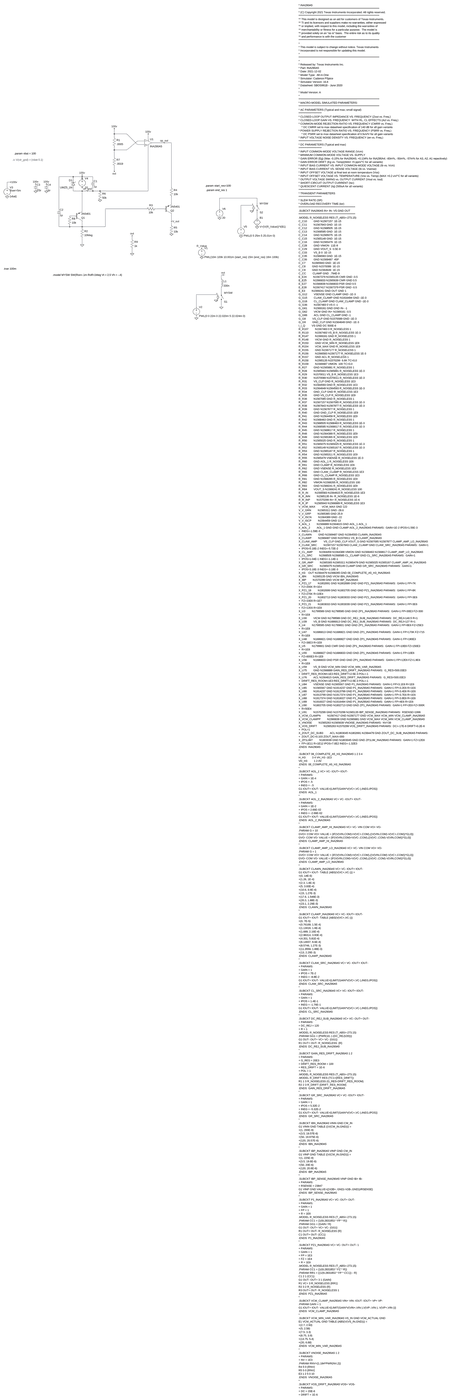
[diagram p0: schematic high_common_mode_shunt.asc, whole sheet]
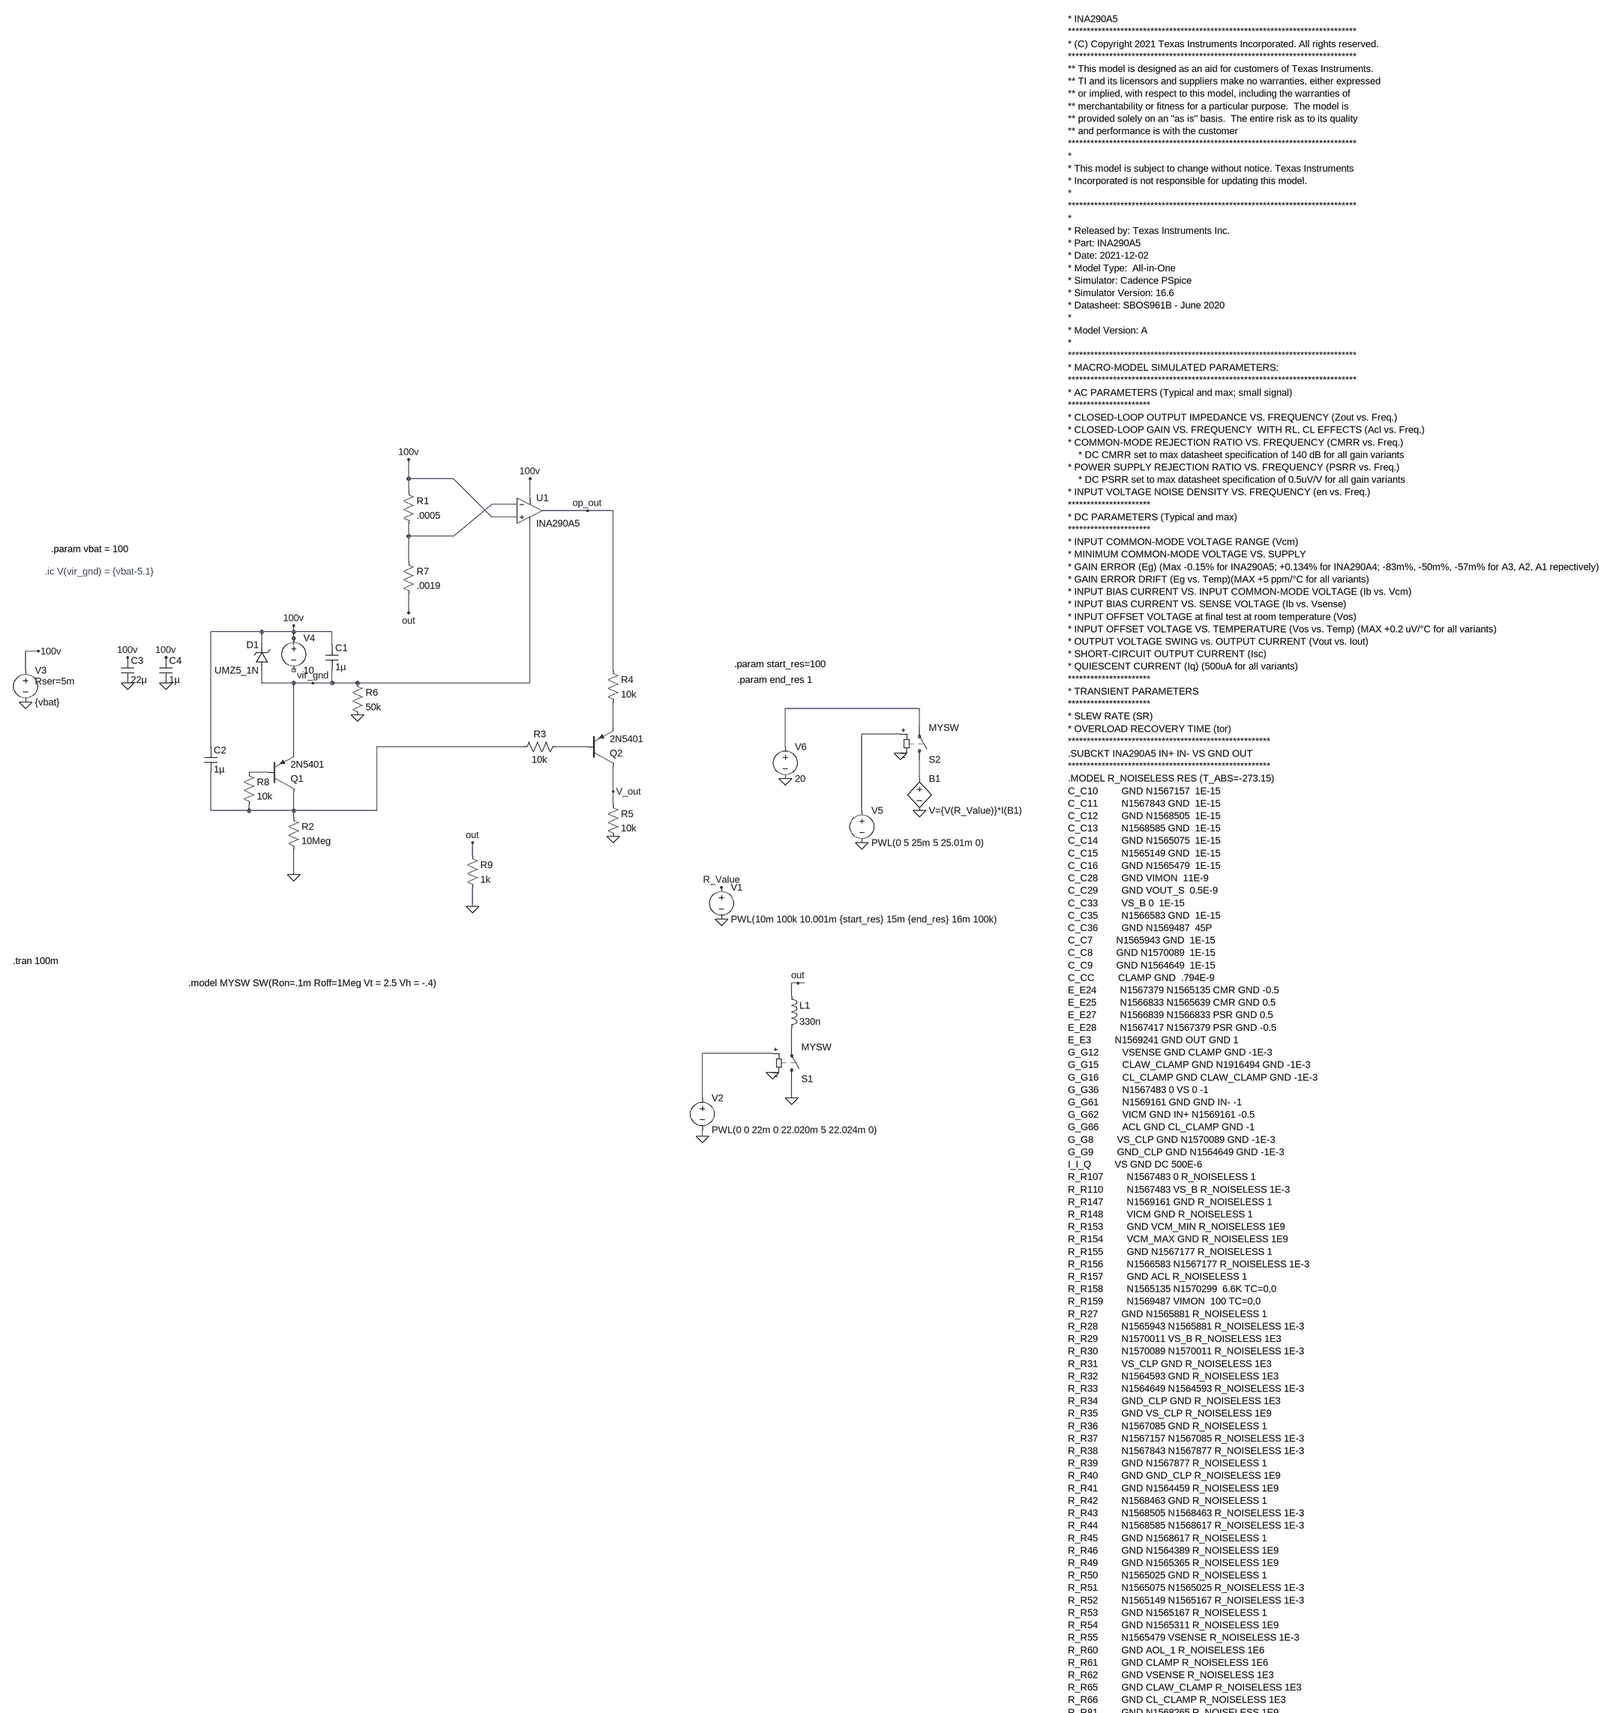
[diagram p1: schematic high_common_mode_shunt.asc, part, row 1 of 3, column 1 of 1]
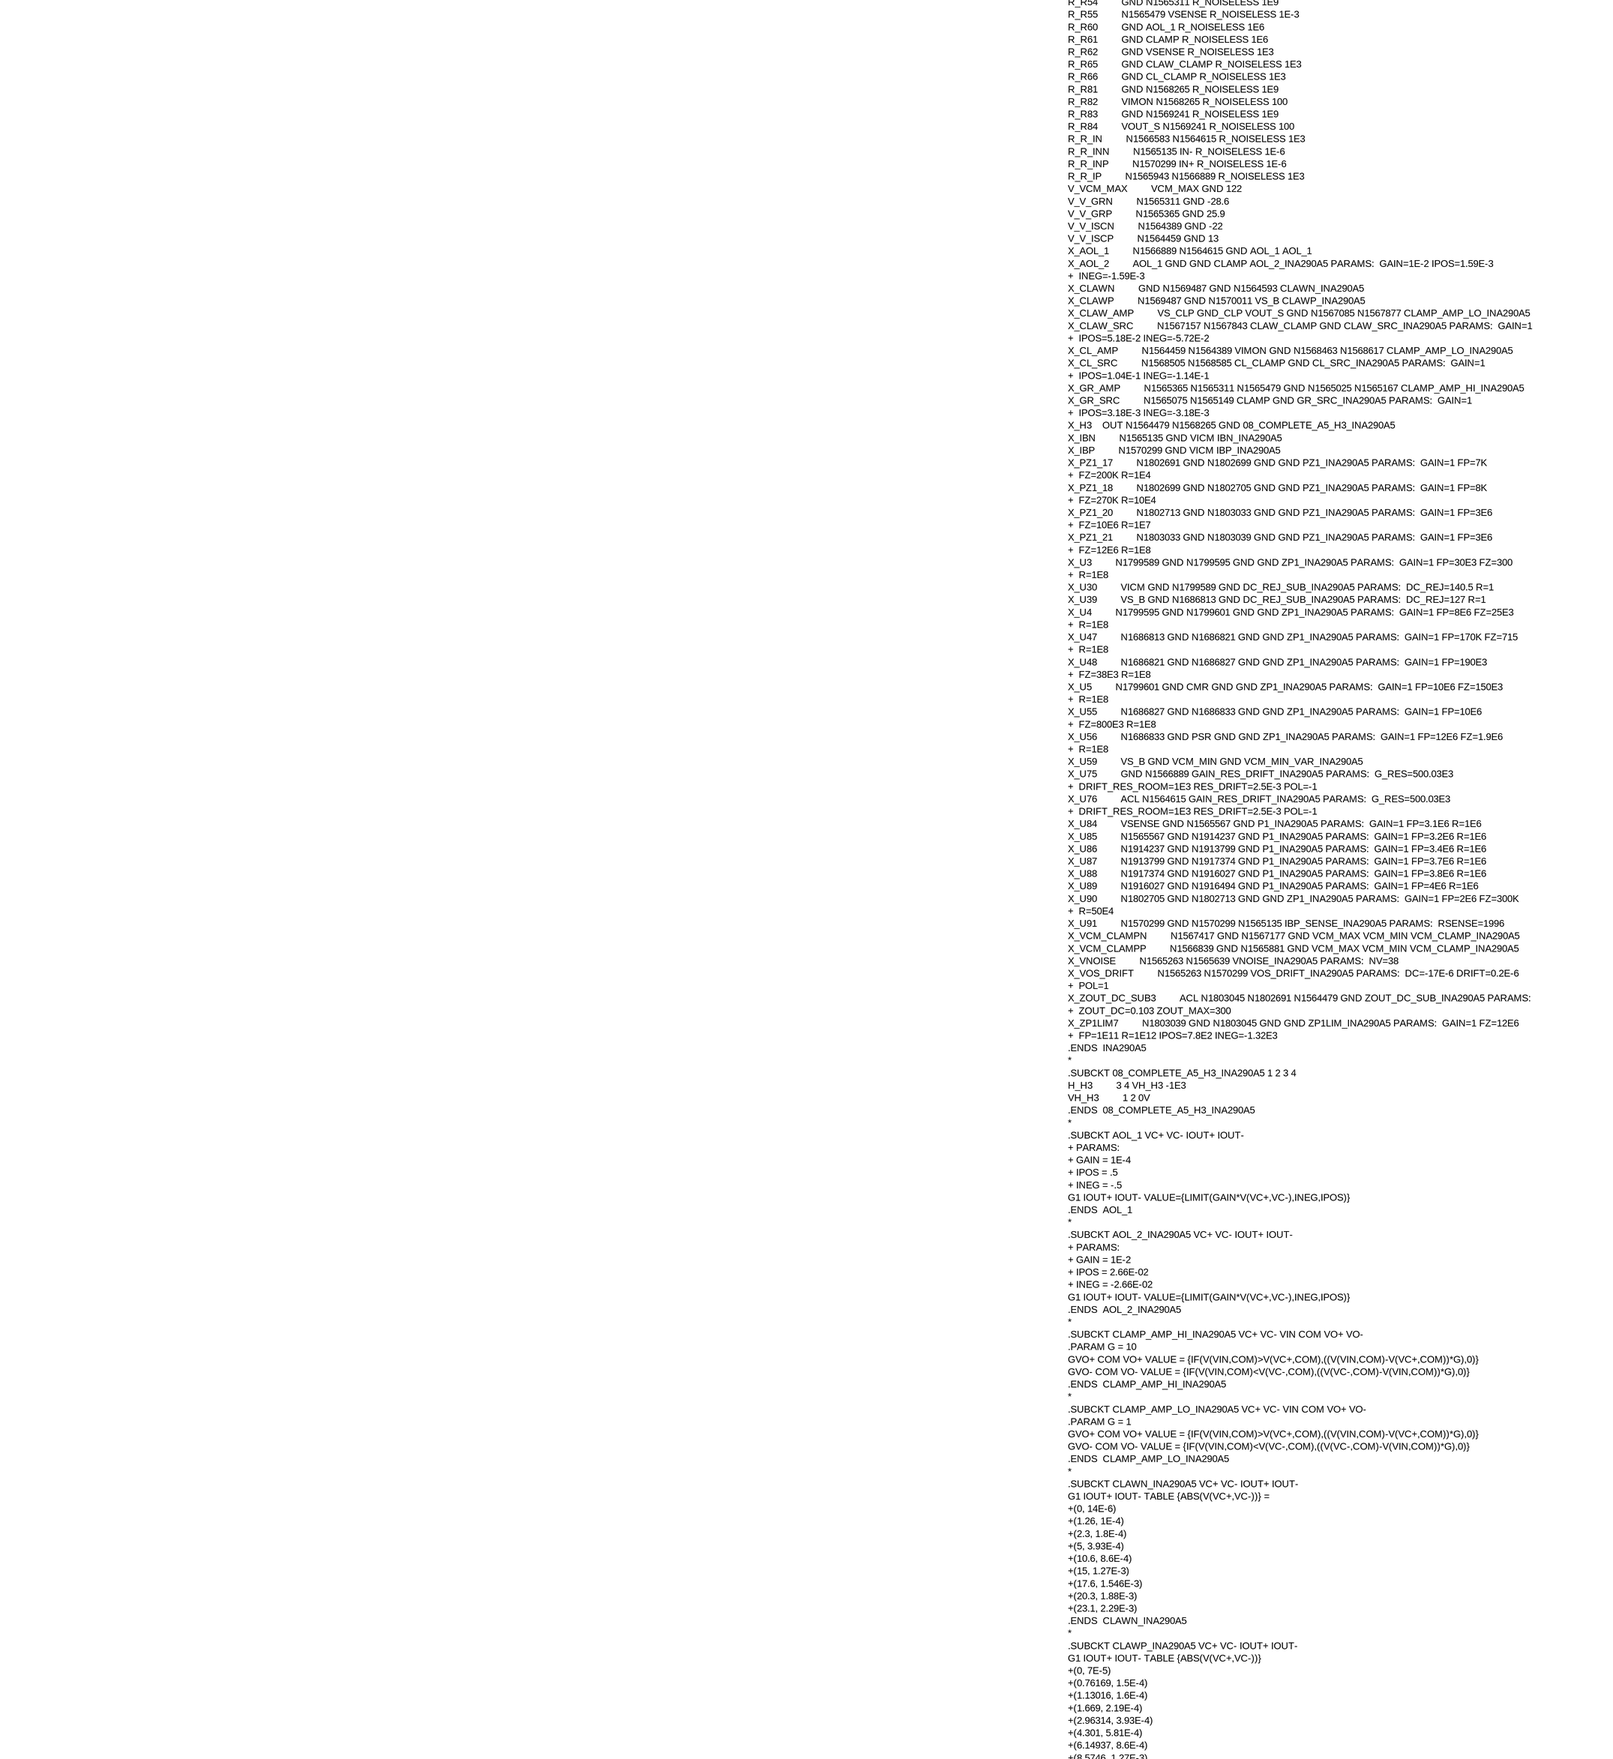
[diagram p2: schematic high_common_mode_shunt.asc, part, row 2 of 3, column 1 of 1]
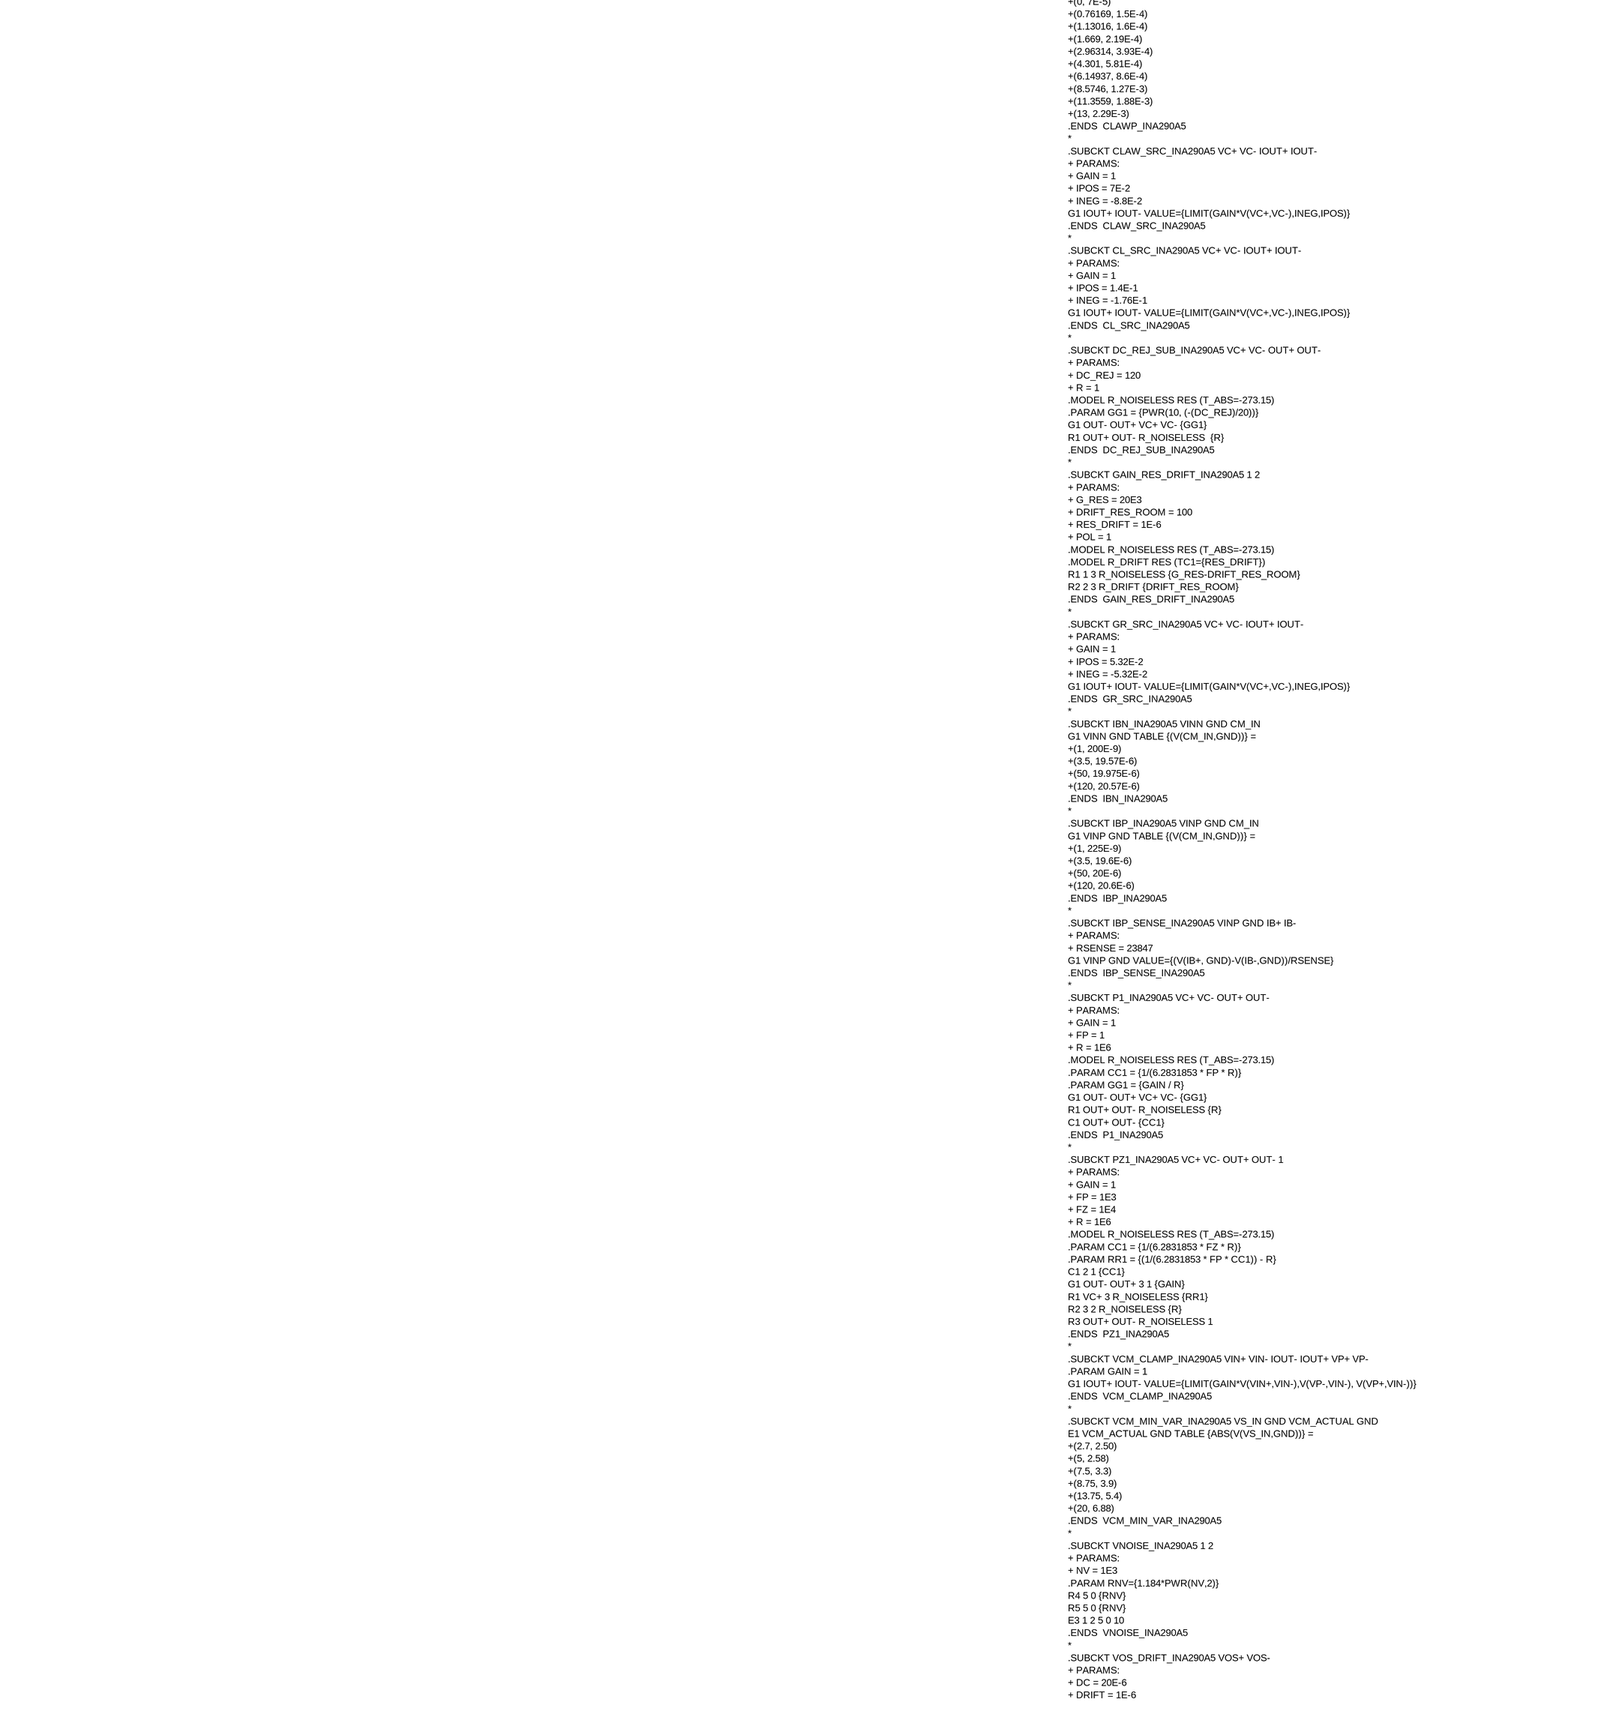
[diagram p3: schematic high_common_mode_shunt.asc, part, row 3 of 3, column 1 of 1]
high_common_mode_shunt.asc, the LTspice schematic file:
Version 4
SHEET 1 2880 10728
WIRE -704 -848 -704 -896
WIRE -592 -848 -704 -848
WIRE -704 -816 -704 -848
WIRE -400 -800 -400 -848
WIRE -432 -784 -496 -784
WIRE -256 -768 -368 -768
WIRE -192 -768 -256 -768
WIRE -496 -752 -592 -848
WIRE -432 -752 -496 -752
WIRE -704 -704 -704 -736
WIRE -592 -704 -496 -784
WIRE -592 -704 -704 -704
WIRE -704 -640 -704 -704
WIRE -704 -512 -704 -560
WIRE -1072 -464 -1200 -464
WIRE -992 -464 -992 -480
WIRE -992 -464 -1072 -464
WIRE -896 -464 -992 -464
WIRE -992 -448 -992 -464
WIRE -1072 -432 -1072 -464
WIRE -992 -432 -992 -448
WIRE -896 -432 -896 -464
WIRE -1632 -416 -1664 -416
WIRE -1664 -368 -1664 -416
WIRE -192 -368 -192 -768
WIRE -1072 -336 -1072 -368
WIRE -992 -336 -1072 -336
WIRE -944 -336 -992 -336
WIRE -896 -336 -896 -368
WIRE -896 -336 -944 -336
WIRE -832 -336 -896 -336
WIRE -400 -336 -400 -736
WIRE -400 -336 -832 -336
WIRE 720 -272 384 -272
WIRE -192 -224 -192 -288
WIRE 720 -224 720 -272
WIRE 672 -208 576 -208
WIRE -1200 -176 -1200 -464
WIRE -416 -176 -784 -176
WIRE -256 -176 -336 -176
WIRE 384 -176 384 -272
WIRE -992 -160 -992 -336
WIRE -1056 -112 -1104 -112
WIRE 720 -96 720 -144
WIRE -192 -64 -192 -128
WIRE -192 -32 -192 -64
WIRE -1200 -16 -1200 -112
WIRE -1104 -16 -1104 -32
WIRE -1104 -16 -1200 -16
WIRE -992 -16 -992 -64
WIRE -992 -16 -1104 -16
WIRE -784 -16 -784 -176
WIRE -784 -16 -992 -16
WIRE 576 -16 576 -208
WIRE -992 0 -992 -16
WIRE -544 96 -544 64
WIRE -992 144 -992 80
WIRE -544 224 -544 176
WIRE 416 416 400 416
WIRE 432 416 416 416
WIRE 400 448 400 416
WIRE 400 576 400 528
WIRE 352 592 176 592
WIRE 176 704 176 592
WIRE 400 704 400 656
WIRE 176 800 176 784
FLAG 720 -16 0
FLAG 224 256 0
FLAG 224 176 R_Value
FLAG 400 704 0
FLAG 416 416 out
FLAG -704 -896 100v
FLAG -1664 -288 0
FLAG -1632 -416 100v
FLAG -400 -848 100v
FLAG -992 -480 100v
FLAG -192 48 0
FLAG -192 -64 V_out
FLAG -256 -768 op_out
FLAG -704 -512 out
FLAG -832 -256 0
FLAG -944 -336 vir_gnd
FLAG -992 144 0
FLAG -1408 -336 0
FLAG -1408 -400 100v
FLAG -1312 -336 0
FLAG -1312 -400 100v
FLAG -544 64 out
FLAG -544 224 0
FLAG 672 -160 0
FLAG 352 640 0
FLAG 176 800 0
FLAG 576 64 0
FLAG 384 -96 0
SYMBOL bv 720 -112 R0
SYMATTR InstName B1
SYMATTR Value V={V(R_Value)}*I(B1)
SYMBOL voltage 224 160 R0
WINDOW 123 0 0 Left 0
WINDOW 39 0 0 Left 0
SYMATTR InstName V1
SYMATTR Value PWL(10m 100k 10.001m {start_res} 15m {end_res} 16m 100k)
SYMBOL sw 400 672 M180
SYMATTR InstName S1
SYMATTR Value MYSW
SYMBOL voltage 176 688 R0
WINDOW 123 0 0 Left 0
WINDOW 39 0 0 Left 0
SYMATTR InstName V2
SYMATTR Value PWL(0 0 22m 0 22.020m 5 22.024m 0)
SYMBOL ind 384 432 R0
SYMATTR InstName L1
SYMATTR Value 330n
SYMATTR SpiceLine Rser=1m
SYMBOL res -720 -832 R0
SYMATTR InstName R1
SYMATTR Value .0005
SYMBOL voltage -1664 -384 R0
WINDOW 123 0 0 Left 0
WINDOW 39 24 44 Left 2
SYMATTR SpiceLine Rser=5m
SYMATTR InstName V3
SYMATTR Value {vbat}
SYMBOL OpAmps\\opamp2 -400 -832 R0
SYMATTR InstName U1
SYMATTR Value INA290A5
SYMBOL pnp -1056 -64 M180
SYMATTR InstName Q1
SYMATTR Value 2N5401
SYMBOL res -1008 -16 R0
SYMATTR InstName R2
SYMATTR Value 10Meg
SYMBOL res -208 -384 R0
SYMATTR InstName R4
SYMATTR Value 10k
SYMBOL res -208 -48 R0
SYMATTR InstName R5
SYMATTR Value 10k
SYMBOL pnp -256 -128 M180
SYMATTR InstName Q2
SYMATTR Value 2N5401
SYMBOL res -848 -352 R0
SYMATTR InstName R6
SYMATTR Value 50k
SYMBOL cap -912 -432 R0
SYMATTR InstName C1
SYMATTR Value 1µ
SYMBOL cap -1216 -176 R0
SYMATTR InstName C2
SYMATTR Value 1µ
SYMBOL cap -1424 -400 R0
SYMATTR InstName C3
SYMATTR Value 22µ
SYMATTR SpiceLine Irms=.5 Rser=.080
SYMBOL cap -1328 -400 R0
SYMATTR InstName C4
SYMATTR Value 1µ
SYMATTR SpiceLine Rser=.005
SYMBOL res -720 -656 R0
SYMATTR InstName R7
SYMATTR Value .0019
SYMBOL res -560 80 R0
SYMATTR InstName R9
SYMATTR Value 1k
SYMBOL voltage -992 -464 R0
WINDOW 123 0 0 Left 0
WINDOW 39 0 0 Left 0
SYMATTR InstName V4
SYMATTR Value 10
SYMBOL sw 720 -128 M180
SYMATTR InstName S2
SYMATTR Value MYSW
SYMBOL voltage 576 -32 R0
WINDOW 123 0 0 Left 0
WINDOW 39 0 0 Left 0
SYMATTR InstName V5
SYMATTR Value PWL(0 5 25m 5 25.01m 0)
SYMBOL voltage 384 -192 R0
WINDOW 123 0 0 Left 0
WINDOW 39 0 0 Left 0
SYMATTR InstName V6
SYMATTR Value 20
SYMBOL res -320 -192 R90
WINDOW 0 0 56 VBottom 2
WINDOW 3 32 56 VTop 2
SYMATTR InstName R3
SYMATTR Value 10k
SYMBOL zener -1056 -368 R180
WINDOW 0 24 64 Left 2
WINDOW 3 24 0 Left 2
SYMATTR InstName D1
SYMATTR Value UMZ5_1N
SYMATTR Description Diode
SYMATTR Type diode
SYMBOL res -1120 -128 R0
SYMATTR InstName R8
SYMATTR Value 10k
TEXT -1696 360 Left 2 !.tran 100m
TEXT 1408 -2000 Left 2 !* INA290A5\n*****************************************************************************\n* (C) Copyright 2021 Texas Instruments Incorporated. All rights reserved.   \n*****************************************************************************\n** This model is designed as an aid for customers of Texas Instruments.\n** TI and its licensors and suppliers make no warranties, either expressed\n** or implied, with respect to this model, including the warranties of\n** merchantability or fitness for a particular purpose.  The model is\n** provided solely on an "as is" basis.  The entire risk as to its quality\n** and performance is with the customer\n*****************************************************************************\n*\n* This model is subject to change without notice. Texas Instruments\n* Incorporated is not responsible for updating this model.\n*\n*****************************************************************************\n*\n* Released by: Texas Instruments Inc.\n* Part: INA290A5\n* Date: 2021-12-02\n* Model Type:  All-in-One\n* Simulator: Cadence PSpice\n* Simulator Version: 16.6\n* Datasheet: SBOS961B - June 2020\n*\n* Model Version: A\n*\n*****************************************************************************   \n* MACRO-MODEL SIMULATED PARAMETERS:\n*****************************************************************************\n* AC PARAMETERS (Typical and max; small signal)\n**********************\n* CLOSED-LOOP OUTPUT IMPEDANCE VS. FREQUENCY (Zout vs. Freq.)\n* CLOSED-LOOP GAIN VS. FREQUENCY  WITH RL, CL EFFECTS (Acl vs. Freq.)\n* COMMON-MODE REJECTION RATIO VS. FREQUENCY (CMRR vs. Freq.)\n    * DC CMRR set to max datasheet specification of 140 dB for all gain variants\n* POWER SUPPLY REJECTION RATIO VS. FREQUENCY (PSRR vs. Freq.)\n    * DC PSRR set to max datasheet specification of 0.5uV/V for all gain variants\n* INPUT VOLTAGE NOISE DENSITY VS. FREQUENCY (en vs. Freq.)\n**********************\n* DC PARAMETERS (Typical and max)\n**********************\n* INPUT COMMON-MODE VOLTAGE RANGE (Vcm)\n* MINIMUM COMMON-MODE VOLTAGE VS. SUPPLY\n* GAIN ERROR (Eg) (Max -0.15% for INA290A5; +0.134% for INA290A4; -83m%, -50m%, -57m% for A3, A2, A1 repectively)\n* GAIN ERROR DRIFT (Eg vs. Temp)(MAX +5 ppm/°C for all variants)\n* INPUT BIAS CURRENT VS. INPUT COMMON-MODE VOLTAGE (Ib vs. Vcm)\n* INPUT BIAS CURRENT VS. SENSE VOLTAGE (Ib vs. Vsense)\n* INPUT OFFSET VOLTAGE at final test at room temperature (Vos)\n* INPUT OFFSET VOLTAGE VS. TEMPERATURE (Vos vs. Temp) (MAX +0.2 uV/°C for all variants)\n* OUTPUT VOLTAGE SWING vs. OUTPUT CURRENT (Vout vs. Iout)\n* SHORT-CIRCUIT OUTPUT CURRENT (Isc)\n* QUIESCENT CURRENT (Iq) (500uA for all variants)\n**********************\n* TRANSIENT PARAMETERS\n**********************\n* SLEW RATE (SR)\n* OVERLOAD RECOVERY TIME (tor)\n******************************************************\n.SUBCKT INA290A5 IN+ IN- VS GND OUT\n******************************************************\n.MODEL R_NOISELESS RES (T_ABS=-273.15)\nC_C10         GND N1567157  1E-15   \nC_C11         N1567843 GND  1E-15   \nC_C12         GND N1568505  1E-15   \nC_C13         N1568585 GND  1E-15   \nC_C14         GND N1565075  1E-15   \nC_C15         N1565149 GND  1E-15   \nC_C16         GND N1565479  1E-15   \nC_C28         GND VIMON  11E-9   \nC_C29         GND VOUT_S  0.5E-9   \nC_C33         VS_B 0  1E-15   \nC_C35         N1566583 GND  1E-15   \nC_C36         GND N1569487  45P   \nC_C7         N1565943 GND  1E-15   \nC_C8         GND N1570089  1E-15   \nC_C9         GND N1564649  1E-15   \nC_CC         CLAMP GND  .794E-9   \nE_E24         N1567379 N1565135 CMR GND -0.5\nE_E25         N1566833 N1565639 CMR GND 0.5\nE_E27         N1566839 N1566833 PSR GND 0.5\nE_E28         N1567417 N1567379 PSR GND -0.5\nE_E3         N1569241 GND OUT GND 1\nG_G12         VSENSE GND CLAMP GND -1E-3\nG_G15         CLAW_CLAMP GND N1916494 GND -1E-3\nG_G16         CL_CLAMP GND CLAW_CLAMP GND -1E-3\nG_G36         N1567483 0 VS 0 -1\nG_G61         N1569161 GND GND IN- -1\nG_G62         VICM GND IN+ N1569161 -0.5\nG_G66         ACL GND CL_CLAMP GND -1\nG_G8         VS_CLP GND N1570089 GND -1E-3\nG_G9         GND_CLP GND N1564649 GND -1E-3\nI_I_Q         VS GND DC 500E-6  \nR_R107         N1567483 0 R_NOISELESS 1\nR_R110         N1567483 VS_B R_NOISELESS 1E-3\nR_R147         N1569161 GND R_NOISELESS 1\nR_R148         VICM GND R_NOISELESS 1\nR_R153         GND VCM_MIN R_NOISELESS 1E9\nR_R154         VCM_MAX GND R_NOISELESS 1E9\nR_R155         GND N1567177 R_NOISELESS 1\nR_R156         N1566583 N1567177 R_NOISELESS 1E-3\nR_R157         GND ACL R_NOISELESS 1\nR_R158         N1565135 N1570299  6.6K TC=0,0 \nR_R159         N1569487 VIMON  100 TC=0,0 \nR_R27         GND N1565881 R_NOISELESS 1\nR_R28         N1565943 N1565881 R_NOISELESS 1E-3\nR_R29         N1570011 VS_B R_NOISELESS 1E3\nR_R30         N1570089 N1570011 R_NOISELESS 1E-3\nR_R31         VS_CLP GND R_NOISELESS 1E3\nR_R32         N1564593 GND R_NOISELESS 1E3\nR_R33         N1564649 N1564593 R_NOISELESS 1E-3\nR_R34         GND_CLP GND R_NOISELESS 1E3\nR_R35         GND VS_CLP R_NOISELESS 1E9\nR_R36         N1567085 GND R_NOISELESS 1\nR_R37         N1567157 N1567085 R_NOISELESS 1E-3\nR_R38         N1567843 N1567877 R_NOISELESS 1E-3\nR_R39         GND N1567877 R_NOISELESS 1\nR_R40         GND GND_CLP R_NOISELESS 1E9\nR_R41         GND N1564459 R_NOISELESS 1E9\nR_R42         N1568463 GND R_NOISELESS 1\nR_R43         N1568505 N1568463 R_NOISELESS 1E-3\nR_R44         N1568585 N1568617 R_NOISELESS 1E-3\nR_R45         GND N1568617 R_NOISELESS 1\nR_R46         GND N1564389 R_NOISELESS 1E9\nR_R49         GND N1565365 R_NOISELESS 1E9\nR_R50         N1565025 GND R_NOISELESS 1\nR_R51         N1565075 N1565025 R_NOISELESS 1E-3\nR_R52         N1565149 N1565167 R_NOISELESS 1E-3\nR_R53         GND N1565167 R_NOISELESS 1\nR_R54         GND N1565311 R_NOISELESS 1E9\nR_R55         N1565479 VSENSE R_NOISELESS 1E-3\nR_R60         GND AOL_1 R_NOISELESS 1E6\nR_R61         GND CLAMP R_NOISELESS 1E6\nR_R62         GND VSENSE R_NOISELESS 1E3\nR_R65         GND CLAW_CLAMP R_NOISELESS 1E3\nR_R66         GND CL_CLAMP R_NOISELESS 1E3\nR_R81         GND N1568265 R_NOISELESS 1E9\nR_R82         VIMON N1568265 R_NOISELESS 100\nR_R83         GND N1569241 R_NOISELESS 1E9\nR_R84         VOUT_S N1569241 R_NOISELESS 100\nR_R_IN         N1566583 N1564615 R_NOISELESS 1E3\nR_R_INN         N1565135 IN- R_NOISELESS 1E-6\nR_R_INP         N1570299 IN+ R_NOISELESS 1E-6\nR_R_IP         N1565943 N1566889 R_NOISELESS 1E3\nV_VCM_MAX         VCM_MAX GND 122\nV_V_GRN         N1565311 GND -28.6\nV_V_GRP         N1565365 GND 25.9\nV_V_ISCN         N1564389 GND -22\nV_V_ISCP         N1564459 GND 13\nX_AOL_1         N1566889 N1564615 GND AOL_1 AOL_1 \nX_AOL_2         AOL_1 GND GND CLAMP AOL_2_INA290A5 PARAMS:  GAIN=1E-2 IPOS=1.59E-3\n+  INEG=-1.59E-3\nX_CLAWN         GND N1569487 GND N1564593 CLAWN_INA290A5 \nX_CLAWP         N1569487 GND N1570011 VS_B CLAWP_INA290A5 \nX_CLAW_AMP         VS_CLP GND_CLP VOUT_S GND N1567085 N1567877 CLAMP_AMP_LO_INA290A5 \nX_CLAW_SRC         N1567157 N1567843 CLAW_CLAMP GND CLAW_SRC_INA290A5 PARAMS:  GAIN=1\n+  IPOS=5.18E-2 INEG=-5.72E-2\nX_CL_AMP         N1564459 N1564389 VIMON GND N1568463 N1568617 CLAMP_AMP_LO_INA290A5 \nX_CL_SRC         N1568505 N1568585 CL_CLAMP GND CL_SRC_INA290A5 PARAMS:  GAIN=1\n+  IPOS=1.04E-1 INEG=-1.14E-1\nX_GR_AMP         N1565365 N1565311 N1565479 GND N1565025 N1565167 CLAMP_AMP_HI_INA290A5 \nX_GR_SRC         N1565075 N1565149 CLAMP GND GR_SRC_INA290A5 PARAMS:  GAIN=1\n+  IPOS=3.18E-3 INEG=-3.18E-3\nX_H3    OUT N1564479 N1568265 GND 08_COMPLETE_A5_H3_INA290A5 \nX_IBN         N1565135 GND VICM IBN_INA290A5 \nX_IBP         N1570299 GND VICM IBP_INA290A5 \nX_PZ1_17         N1802691 GND N1802699 GND GND PZ1_INA290A5 PARAMS:  GAIN=1 FP=7K\n+  FZ=200K R=1E4\nX_PZ1_18         N1802699 GND N1802705 GND GND PZ1_INA290A5 PARAMS:  GAIN=1 FP=8K\n+  FZ=270K R=10E4\nX_PZ1_20         N1802713 GND N1803033 GND GND PZ1_INA290A5 PARAMS:  GAIN=1 FP=3E6\n+  FZ=10E6 R=1E7\nX_PZ1_21         N1803033 GND N1803039 GND GND PZ1_INA290A5 PARAMS:  GAIN=1 FP=3E6\n+  FZ=12E6 R=1E8\nX_U3         N1799589 GND N1799595 GND GND ZP1_INA290A5 PARAMS:  GAIN=1 FP=30E3 FZ=300\n+  R=1E8\nX_U30         VICM GND N1799589 GND DC_REJ_SUB_INA290A5 PARAMS:  DC_REJ=140.5 R=1\nX_U39         VS_B GND N1686813 GND DC_REJ_SUB_INA290A5 PARAMS:  DC_REJ=127 R=1\nX_U4         N1799595 GND N1799601 GND GND ZP1_INA290A5 PARAMS:  GAIN=1 FP=8E6 FZ=25E3\n+  R=1E8\nX_U47         N1686813 GND N1686821 GND GND ZP1_INA290A5 PARAMS:  GAIN=1 FP=170K FZ=715\n+  R=1E8\nX_U48         N1686821 GND N1686827 GND GND ZP1_INA290A5 PARAMS:  GAIN=1 FP=190E3\n+  FZ=38E3 R=1E8\nX_U5         N1799601 GND CMR GND GND ZP1_INA290A5 PARAMS:  GAIN=1 FP=10E6 FZ=150E3\n+  R=1E8\nX_U55         N1686827 GND N1686833 GND GND ZP1_INA290A5 PARAMS:  GAIN=1 FP=10E6\n+  FZ=800E3 R=1E8\nX_U56         N1686833 GND PSR GND GND ZP1_INA290A5 PARAMS:  GAIN=1 FP=12E6 FZ=1.9E6\n+  R=1E8\nX_U59         VS_B GND VCM_MIN GND VCM_MIN_VAR_INA290A5 \nX_U75         GND N1566889 GAIN_RES_DRIFT_INA290A5 PARAMS:  G_RES=500.03E3\n+  DRIFT_RES_ROOM=1E3 RES_DRIFT=2.5E-3 POL=-1\nX_U76         ACL N1564615 GAIN_RES_DRIFT_INA290A5 PARAMS:  G_RES=500.03E3\n+  DRIFT_RES_ROOM=1E3 RES_DRIFT=2.5E-3 POL=-1\nX_U84         VSENSE GND N1565567 GND P1_INA290A5 PARAMS:  GAIN=1 FP=3.1E6 R=1E6\nX_U85         N1565567 GND N1914237 GND P1_INA290A5 PARAMS:  GAIN=1 FP=3.2E6 R=1E6\nX_U86         N1914237 GND N1913799 GND P1_INA290A5 PARAMS:  GAIN=1 FP=3.4E6 R=1E6\nX_U87         N1913799 GND N1917374 GND P1_INA290A5 PARAMS:  GAIN=1 FP=3.7E6 R=1E6\nX_U88         N1917374 GND N1916027 GND P1_INA290A5 PARAMS:  GAIN=1 FP=3.8E6 R=1E6\nX_U89         N1916027 GND N1916494 GND P1_INA290A5 PARAMS:  GAIN=1 FP=4E6 R=1E6\nX_U90         N1802705 GND N1802713 GND GND ZP1_INA290A5 PARAMS:  GAIN=1 FP=2E6 FZ=300K\n+  R=50E4\nX_U91         N1570299 GND N1570299 N1565135 IBP_SENSE_INA290A5 PARAMS:  RSENSE=1996\nX_VCM_CLAMPN         N1567417 GND N1567177 GND VCM_MAX VCM_MIN VCM_CLAMP_INA290A5 \nX_VCM_CLAMPP         N1566839 GND N1565881 GND VCM_MAX VCM_MIN VCM_CLAMP_INA290A5 \nX_VNOISE         N1565263 N1565639 VNOISE_INA290A5 PARAMS:  NV=38\nX_VOS_DRIFT         N1565263 N1570299 VOS_DRIFT_INA290A5 PARAMS:  DC=-17E-6 DRIFT=0.2E-6\n+  POL=1\nX_ZOUT_DC_SUB3         ACL N1803045 N1802691 N1564479 GND ZOUT_DC_SUB_INA290A5 PARAMS: \n+  ZOUT_DC=0.103 ZOUT_MAX=300\nX_ZP1LIM7         N1803039 GND N1803045 GND GND ZP1LIM_INA290A5 PARAMS:  GAIN=1 FZ=12E6\n+  FP=1E11 R=1E12 IPOS=7.8E2 INEG=-1.32E3\n.ENDS  INA290A5\n*\n.SUBCKT 08_COMPLETE_A5_H3_INA290A5 1 2 3 4  \nH_H3         3 4 VH_H3 -1E3\nVH_H3         1 2 0V\n.ENDS  08_COMPLETE_A5_H3_INA290A5\n*\n.SUBCKT AOL_1 VC+ VC- IOUT+ IOUT-\n+ PARAMS:\n+ GAIN = 1E-4\n+ IPOS = .5\n+ INEG = -.5\nG1 IOUT+ IOUT- VALUE={LIMIT(GAIN*V(VC+,VC-),INEG,IPOS)}\n.ENDS  AOL_1\n*\n.SUBCKT AOL_2_INA290A5 VC+ VC- IOUT+ IOUT-\n+ PARAMS:\n+ GAIN = 1E-2\n+ IPOS = 2.66E-02\n+ INEG = -2.66E-02\nG1 IOUT+ IOUT- VALUE={LIMIT(GAIN*V(VC+,VC-),INEG,IPOS)}\n.ENDS  AOL_2_INA290A5\n*\n.SUBCKT CLAMP_AMP_HI_INA290A5 VC+ VC- VIN COM VO+ VO-\n.PARAM G = 10\nGVO+ COM VO+ VALUE = {IF(V(VIN,COM)>V(VC+,COM),((V(VIN,COM)-V(VC+,COM))*G),0)}\nGVO- COM VO- VALUE = {IF(V(VIN,COM)<V(VC-,COM),((V(VC-,COM)-V(VIN,COM))*G),0)}\n.ENDS  CLAMP_AMP_HI_INA290A5\n*\n.SUBCKT CLAMP_AMP_LO_INA290A5 VC+ VC- VIN COM VO+ VO-\n.PARAM G = 1\nGVO+ COM VO+ VALUE = {IF(V(VIN,COM)>V(VC+,COM),((V(VIN,COM)-V(VC+,COM))*G),0)}\nGVO- COM VO- VALUE = {IF(V(VIN,COM)<V(VC-,COM),((V(VC-,COM)-V(VIN,COM))*G),0)}\n.ENDS  CLAMP_AMP_LO_INA290A5\n*\n.SUBCKT CLAWN_INA290A5 VC+ VC- IOUT+ IOUT-\nG1 IOUT+ IOUT- TABLE {ABS(V(VC+,VC-))} =\n+(0, 14E-6)\n+(1.26, 1E-4)\n+(2.3, 1.8E-4)\n+(5, 3.93E-4)\n+(10.6, 8.6E-4)\n+(15, 1.27E-3)\n+(17.6, 1.546E-3)\n+(20.3, 1.88E-3)\n+(23.1, 2.29E-3)\n.ENDS  CLAWN_INA290A5\n*\n.SUBCKT CLAWP_INA290A5 VC+ VC- IOUT+ IOUT-\nG1 IOUT+ IOUT- TABLE {ABS(V(VC+,VC-))}\n+(0, 7E-5)\n+(0.76169, 1.5E-4)\n+(1.13016, 1.6E-4)\n+(1.669, 2.19E-4)\n+(2.96314, 3.93E-4)\n+(4.301, 5.81E-4)\n+(6.14937, 8.6E-4)\n+(8.5746, 1.27E-3)\n+(11.3559, 1.88E-3)\n+(13, 2.29E-3)\n.ENDS  CLAWP_INA290A5\n*\n.SUBCKT CLAW_SRC_INA290A5 VC+ VC- IOUT+ IOUT-\n+ PARAMS:\n+ GAIN = 1\n+ IPOS = 7E-2\n+ INEG = -8.8E-2\nG1 IOUT+ IOUT- VALUE={LIMIT(GAIN*V(VC+,VC-),INEG,IPOS)}\n.ENDS  CLAW_SRC_INA290A5\n*\n.SUBCKT CL_SRC_INA290A5 VC+ VC- IOUT+ IOUT-\n+ PARAMS:\n+ GAIN = 1\n+ IPOS = 1.4E-1\n+ INEG = -1.76E-1\nG1 IOUT+ IOUT- VALUE={LIMIT(GAIN*V(VC+,VC-),INEG,IPOS)}\n.ENDS  CL_SRC_INA290A5\n*\n.SUBCKT DC_REJ_SUB_INA290A5 VC+ VC- OUT+ OUT-\n+ PARAMS:\n+ DC_REJ = 120\n+ R = 1\n.MODEL R_NOISELESS RES (T_ABS=-273.15)\n.PARAM GG1 = {PWR(10, (-(DC_REJ)/20))}\nG1 OUT- OUT+ VC+ VC- {GG1}\nR1 OUT+ OUT- R_NOISELESS  {R}\n.ENDS  DC_REJ_SUB_INA290A5\n*\n.SUBCKT GAIN_RES_DRIFT_INA290A5 1 2\n+ PARAMS:\n+ G_RES = 20E3\n+ DRIFT_RES_ROOM = 100\n+ RES_DRIFT = 1E-6\n+ POL = 1\n.MODEL R_NOISELESS RES (T_ABS=-273.15)\n.MODEL R_DRIFT RES (TC1={RES_DRIFT})\nR1 1 3 R_NOISELESS {G_RES-DRIFT_RES_ROOM}\nR2 2 3 R_DRIFT {DRIFT_RES_ROOM}\n.ENDS  GAIN_RES_DRIFT_INA290A5\n*\n.SUBCKT GR_SRC_INA290A5 VC+ VC- IOUT+ IOUT-\n+ PARAMS:\n+ GAIN = 1\n+ IPOS = 5.32E-2\n+ INEG = -5.32E-2\nG1 IOUT+ IOUT- VALUE={LIMIT(GAIN*V(VC+,VC-),INEG,IPOS)}\n.ENDS  GR_SRC_INA290A5\n*\n.SUBCKT IBN_INA290A5 VINN GND CM_IN\nG1 VINN GND TABLE {(V(CM_IN,GND))} =\n+(1, 200E-9)\n+(3.5, 19.57E-6)\n+(50, 19.975E-6)\n+(120, 20.57E-6)\n.ENDS  IBN_INA290A5\n*\n.SUBCKT IBP_INA290A5 VINP GND CM_IN\nG1 VINP GND TABLE {(V(CM_IN,GND))} =\n+(1, 225E-9)\n+(3.5, 19.6E-6)\n+(50, 20E-6)\n+(120, 20.6E-6)\n.ENDS  IBP_INA290A5\n*\n.SUBCKT IBP_SENSE_INA290A5 VINP GND IB+ IB-\n+ PARAMS:\n+ RSENSE = 23847\nG1 VINP GND VALUE={(V(IB+, GND)-V(IB-,GND))/RSENSE}\n.ENDS  IBP_SENSE_INA290A5\n*\n.SUBCKT P1_INA290A5 VC+ VC- OUT+ OUT-\n+ PARAMS: \n+ GAIN = 1\n+ FP = 1\n+ R = 1E6\n.MODEL R_NOISELESS RES (T_ABS=-273.15)\n.PARAM CC1 = {1/(6.2831853 * FP * R)}\n.PARAM GG1 = {GAIN / R}\nG1 OUT- OUT+ VC+ VC- {GG1}\nR1 OUT+ OUT- R_NOISELESS {R}\nC1 OUT+ OUT- {CC1}\n.ENDS  P1_INA290A5\n*\n.SUBCKT PZ1_INA290A5 VC+ VC- OUT+ OUT- 1\n+ PARAMS: \n+ GAIN = 1\n+ FP = 1E3\n+ FZ = 1E4\n+ R = 1E6\n.MODEL R_NOISELESS RES (T_ABS=-273.15)\n.PARAM CC1 = {1/(6.2831853 * FZ * R)}\n.PARAM RR1 = {(1/(6.2831853 * FP * CC1)) - R}\nC1 2 1 {CC1}\nG1 OUT- OUT+ 3 1 {GAIN}\nR1 VC+ 3 R_NOISELESS {RR1}\nR2 3 2 R_NOISELESS {R}\nR3 OUT+ OUT- R_NOISELESS 1\n.ENDS  PZ1_INA290A5\n*\n.SUBCKT VCM_CLAMP_INA290A5 VIN+ VIN- IOUT- IOUT+ VP+ VP-\n.PARAM GAIN = 1\nG1 IOUT+ IOUT- VALUE={LIMIT(GAIN*V(VIN+,VIN-),V(VP-,VIN-), V(VP+,VIN-))}\n.ENDS  VCM_CLAMP_INA290A5\n*\n.SUBCKT VCM_MIN_VAR_INA290A5 VS_IN GND VCM_ACTUAL GND\nE1 VCM_ACTUAL GND TABLE {ABS(V(VS_IN,GND))} =\n+(2.7, 2.50)\n+(5, 2.58)\n+(7.5, 3.3)\n+(8.75, 3.9)\n+(13.75, 5.4)\n+(20, 6.88)\n.ENDS  VCM_MIN_VAR_INA290A5\n*\n.SUBCKT VNOISE_INA290A5 1 2\n+ PARAMS:\n+ NV = 1E3\n.PARAM RNV={1.184*PWR(NV,2)}\nR4 5 0 {RNV}\nR5 5 0 {RNV}\nE3 1 2 5 0 10\n.ENDS  VNOISE_INA290A5\n*\n.SUBCKT VOS_DRIFT_INA290A5 VOS+ VOS-\n+ PARAMS:\n+ DC = 20E-6\n+ DRIFT = 1E-6\n+ POL = 1\nE1 VOS+ VOS- VALUE={DC+POL*DRIFT*(TEMP-27)}\n.ENDS  VOS_DRIFT_INA290A5\n*\n.SUBCKT ZOUT_DC_SUB_INA290A5 INA INB OUTA OUTB COM\n+ PARAMS:\n+ ZOUT_DC = 1\n+ ZOUT_MAX = 1E3\n.MODEL R_NOISELESS RES (T_ABS=-273.15)\n.PARAM BETA = 1\n.PARAM RDUMMY = {10*ZOUT_MAX}\n.PARAM RX = {100*ZOUT_MAX}\n.PARAM G1 = {RX/(ZOUT_DC*BETA)}\nG1 COM OUTA INA OUTB {G1}\nR1 OUTA COM R_NOISELESS 1\nRDUMMY OUTB COM R_NOISELESS {RDUMMY}\nRX INB OUTB R_NOISELESS {RX}\n.ENDS  ZOUT_DC_SUB_INA290A5\n*\n.SUBCKT ZP1_INA290A5 VC+ VC- OUT+ OUT- 1\n+ PARAMS:\n+ GAIN = 1\n+ FZ = 1E3\n+ FP = 1E4\n+ R = 1E6\n.MODEL R_NOISELESS RES (T_ABS=-273.15)\n.PARAM GG1 = {GAIN * FP/FZ}\n.PARAM CC1 = {1/(6.2831853 * FZ * R)}\n.PARAM RR1 = {R/(FP/FZ - 1)}\nC1 VC+ 2 {CC1}\nG1 OUT- OUT+ 2 1 {GG1}\nR1 VC+ 2 R_NOISELESS {R}\nR2 2 1 R_NOISELESS {RR1}\nR3 OUT+ OUT- R_NOISELESS 1\n.ENDS  ZP1_INA290A5\n*\n.SUBCKT ZP1LIM_INA290A5 VC+ VC- OUT+ OUT- 1\n+ PARAMS:\n+ GAIN = 1\n+ FZ = 1E3\n+ FP = 1E4\n+ R = 1E6\n+ IPOS = 1.72E3\n+ INEG = -2.9E3\n.MODEL R_NOISELESS RES (T_ABS=-273.15)\n.PARAM GG1 = {GAIN * FP/FZ}\n.PARAM CC1 = {1/(6.2831853 * FZ * R)}\n.PARAM RR1 = {R/(FP/FZ - 1)}\nC1 VC+ 2 {CC1}\nG1 OUT- OUT+ VALUE={LIMIT(GG1 * V(2, 1), INEG, IPOS)}\nR1 VC+ 2 R_NOISELESS {R}\nR2 2 1 R_NOISELESS {RR1}\nR3 OUT+ OUT- R_NOISELESS 1\n.ENDS  ZP1LIM_INA290A5\n*
TEXT -1256 416 Left 2 !.model MYSW SW(Ron=.1m Roff=1Meg Vt = 2.5 Vh = -.4)
TEXT 256 -384 Left 2 !.param start_res=100
TEXT 264 -344 Left 2 !.param end_res 1
TEXT -1616 -616 Left 2 ;.ic V(vir_gnd) = {vbat-5.1}
TEXT -1600 -672 Left 2 !.param vbat = 100

The netlist it stands for:
* high_common_mode_shunt.asc
B1 N008 0 V={V(R_Value)}*I(B1)
V1 R_Value 0 PWL(10m 100k 10.001m {start_res} 15m {end_res} 16m 100k)
S1 0 N009 N010 0 MYSW
V2 N010 0 PWL(0 0 22m 0 22.020m 5 22.024m 0)
L1 out N009 330n Rser=1m
R1 100v N001 .0005
V3 100v 0 {vbat} Rser=5m
XU1 100v N001 100v vir_gnd op_out INA290A5  ; pins In+ In- V+ V- OUT
Q1 N005 N007 vir_gnd 0 2N5401
R2 N005 0 10Meg
R4 op_out N003 10k
R5 V_out 0 10k
Q2 V_out N006 N003 0 2N5401
R6 vir_gnd 0 50k
C1 100v vir_gnd 1µ
C2 100v N005 1µ
C3 100v 0 22µ Irms=.5 Rser=.080
C4 100v 0 1µ Rser=.005
R7 N001 out .0019
R9 out 0 1k
V4 100v NC_01 10
S2 N008 N002 N004 0 MYSW
V5 N004 0 PWL(0 5 25m 5 25.01m 0)
V6 N002 0 20
R3 N006 N005 10k
D1 vir_gnd 100v UMZ5_1N
R8 N007 N005 10k
.model D D
.lib standard.dio
.model NPN NPN
.model PNP PNP
.lib standard.bjt
.tran 100m
* INA290A5
*****************************************************************************
* (C) Copyright 2021 Texas Instruments Incorporated. All rights reserved.
*****************************************************************************
** This model is designed as an aid for customers of Texas Instruments.
** TI and its licensors and suppliers make no warranties, either expressed
** or implied, with respect to this model, including the warranties of
** merchantability or fitness for a particular purpose.  The model is
** provided solely on an "as is" basis.  The entire risk as to its quality
** and performance is with the customer
*****************************************************************************
*
* This model is subject to change without notice. Texas Instruments
* Incorporated is not responsible for updating this model.
*
*****************************************************************************
*
* Released by: Texas Instruments Inc.
* Part: INA290A5
* Date: 2021-12-02
* Model Type:  All-in-One
* Simulator: Cadence PSpice
* Simulator Version: 16.6
* Datasheet: SBOS961B - June 2020
*
* Model Version: A
*
*****************************************************************************
* MACRO-MODEL SIMULATED PARAMETERS:
*****************************************************************************
* AC PARAMETERS (Typical and max; small signal)
**********************
* CLOSED-LOOP OUTPUT IMPEDANCE VS. FREQUENCY (Zout vs. Freq.)
* CLOSED-LOOP GAIN VS. FREQUENCY  WITH RL, CL EFFECTS (Acl vs. Freq.)
* COMMON-MODE REJECTION RATIO VS. FREQUENCY (CMRR vs. Freq.)
    * DC CMRR set to max datasheet specification of 140 dB for all gain variants
* POWER SUPPLY REJECTION RATIO VS. FREQUENCY (PSRR vs. Freq.)
    * DC PSRR set to max datasheet specification of 0.5uV/V for all gain variants
* INPUT VOLTAGE NOISE DENSITY VS. FREQUENCY (en vs. Freq.)
**********************
* DC PARAMETERS (Typical and max)
**********************
* INPUT COMMON-MODE VOLTAGE RANGE (Vcm)
* MINIMUM COMMON-MODE VOLTAGE VS. SUPPLY
* GAIN ERROR (Eg) (Max -0.15% for INA290A5; +0.134% for INA290A4; -83m%, -50m%, -57m% for A3, A2, A1 repectively)
* GAIN ERROR DRIFT (Eg vs. Temp)(MAX +5 ppm/°C for all variants)
* INPUT BIAS CURRENT VS. INPUT COMMON-MODE VOLTAGE (Ib vs. Vcm)
* INPUT BIAS CURRENT VS. SENSE VOLTAGE (Ib vs. Vsense)
* INPUT OFFSET VOLTAGE at final test at room temperature (Vos)
* INPUT OFFSET VOLTAGE VS. TEMPERATURE (Vos vs. Temp) (MAX +0.2 uV/°C for all variants)
* OUTPUT VOLTAGE SWING vs. OUTPUT CURRENT (Vout vs. Iout)
* SHORT-CIRCUIT OUTPUT CURRENT (Isc)
* QUIESCENT CURRENT (Iq) (500uA for all variants)
**********************
* TRANSIENT PARAMETERS
**********************
* SLEW RATE (SR)
* OVERLOAD RECOVERY TIME (tor)
******************************************************
.SUBCKT INA290A5 IN+ IN- VS GND OUT
******************************************************
.MODEL R_NOISELESS RES (T_ABS=-273.15)
C_C10         GND N1567157  1E-15
C_C11         N1567843 GND  1E-15
C_C12         GND N1568505  1E-15
C_C13         N1568585 GND  1E-15
C_C14         GND N1565075  1E-15
C_C15         N1565149 GND  1E-15
C_C16         GND N1565479  1E-15
C_C28         GND VIMON  11E-9
C_C29         GND VOUT_S  0.5E-9
C_C33         VS_B 0  1E-15
C_C35         N1566583 GND  1E-15
C_C36         GND N1569487  45P
C_C7         N1565943 GND  1E-15
C_C8         GND N1570089  1E-15
C_C9         GND N1564649  1E-15
C_CC         CLAMP GND  .794E-9
E_E24         N1567379 N1565135 CMR GND -0.5
E_E25         N1566833 N1565639 CMR GND 0.5
E_E27         N1566839 N1566833 PSR GND 0.5
E_E28         N1567417 N1567379 PSR GND -0.5
E_E3         N1569241 GND OUT GND 1
G_G12         VSENSE GND CLAMP GND -1E-3
G_G15         CLAW_CLAMP GND N1916494 GND -1E-3
G_G16         CL_CLAMP GND CLAW_CLAMP GND -1E-3
G_G36         N1567483 0 VS 0 -1
G_G61         N1569161 GND GND IN- -1
G_G62         VICM GND IN+ N1569161 -0.5
G_G66         ACL GND CL_CLAMP GND -1
G_G8         VS_CLP GND N1570089 GND -1E-3
G_G9         GND_CLP GND N1564649 GND -1E-3
I_I_Q         VS GND DC 500E-6
R_R107         N1567483 0 R_NOISELESS 1
R_R110         N1567483 VS_B R_NOISELESS 1E-3
R_R147         N1569161 GND R_NOISELESS 1
R_R148         VICM GND R_NOISELESS 1
R_R153         GND VCM_MIN R_NOISELESS 1E9
R_R154         VCM_MAX GND R_NOISELESS 1E9
R_R155         GND N1567177 R_NOISELESS 1
R_R156         N1566583 N1567177 R_NOISELESS 1E-3
R_R157         GND ACL R_NOISELESS 1
R_R158         N1565135 N1570299  6.6K TC=0,0
R_R159         N1569487 VIMON  100 TC=0,0
R_R27         GND N1565881 R_NOISELESS 1
R_R28         N1565943 N1565881 R_NOISELESS 1E-3
R_R29         N1570011 VS_B R_NOISELESS 1E3
R_R30         N1570089 N1570011 R_NOISELESS 1E-3
R_R31         VS_CLP GND R_NOISELESS 1E3
R_R32         N1564593 GND R_NOISELESS 1E3
R_R33         N1564649 N1564593 R_NOISELESS 1E-3
R_R34         GND_CLP GND R_NOISELESS 1E3
R_R35         GND VS_CLP R_NOISELESS 1E9
R_R36         N1567085 GND R_NOISELESS 1
R_R37         N1567157 N1567085 R_NOISELESS 1E-3
R_R38         N1567843 N1567877 R_NOISELESS 1E-3
R_R39         GND N1567877 R_NOISELESS 1
R_R40         GND GND_CLP R_NOISELESS 1E9
R_R41         GND N1564459 R_NOISELESS 1E9
R_R42         N1568463 GND R_NOISELESS 1
R_R43         N1568505 N1568463 R_NOISELESS 1E-3
R_R44         N1568585 N1568617 R_NOISELESS 1E-3
R_R45         GND N1568617 R_NOISELESS 1
R_R46         GND N1564389 R_NOISELESS 1E9
R_R49         GND N1565365 R_NOISELESS 1E9
R_R50         N1565025 GND R_NOISELESS 1
R_R51         N1565075 N1565025 R_NOISELESS 1E-3
R_R52         N1565149 N1565167 R_NOISELESS 1E-3
R_R53         GND N1565167 R_NOISELESS 1
R_R54         GND N1565311 R_NOISELESS 1E9
R_R55         N1565479 VSENSE R_NOISELESS 1E-3
R_R60         GND AOL_1 R_NOISELESS 1E6
R_R61         GND CLAMP R_NOISELESS 1E6
R_R62         GND VSENSE R_NOISELESS 1E3
R_R65         GND CLAW_CLAMP R_NOISELESS 1E3
R_R66         GND CL_CLAMP R_NOISELESS 1E3
R_R81         GND N1568265 R_NOISELESS 1E9
R_R82         VIMON N1568265 R_NOISELESS 100
R_R83         GND N1569241 R_NOISELESS 1E9
R_R84         VOUT_S N1569241 R_NOISELESS 100
R_R_IN         N1566583 N1564615 R_NOISELESS 1E3
R_R_INN         N1565135 IN- R_NOISELESS 1E-6
R_R_INP         N1570299 IN+ R_NOISELESS 1E-6
R_R_IP         N1565943 N1566889 R_NOISELESS 1E3
V_VCM_MAX         VCM_MAX GND 122
V_V_GRN         N1565311 GND -28.6
V_V_GRP         N1565365 GND 25.9
V_V_ISCN         N1564389 GND -22
V_V_ISCP         N1564459 GND 13
X_AOL_1         N1566889 N1564615 GND AOL_1 AOL_1
X_AOL_2         AOL_1 GND GND CLAMP AOL_2_INA290A5 PARAMS:  GAIN=1E-2 IPOS=1.59E-3
+  INEG=-1.59E-3
X_CLAWN         GND N1569487 GND N1564593 CLAWN_INA290A5
X_CLAWP         N1569487 GND N1570011 VS_B CLAWP_INA290A5
X_CLAW_AMP         VS_CLP GND_CLP VOUT_S GND N1567085 N1567877 CLAMP_AMP_LO_INA290A5
X_CLAW_SRC         N1567157 N1567843 CLAW_CLAMP GND CLAW_SRC_INA290A5 PARAMS:  GAIN=1
+  IPOS=5.18E-2 INEG=-5.72E-2
X_CL_AMP         N1564459 N1564389 VIMON GND N1568463 N1568617 CLAMP_AMP_LO_INA290A5
X_CL_SRC         N1568505 N1568585 CL_CLAMP GND CL_SRC_INA290A5 PARAMS:  GAIN=1
+  IPOS=1.04E-1 INEG=-1.14E-1
X_GR_AMP         N1565365 N1565311 N1565479 GND N1565025 N1565167 CLAMP_AMP_HI_INA290A5
X_GR_SRC         N1565075 N1565149 CLAMP GND GR_SRC_INA290A5 PARAMS:  GAIN=1
+  IPOS=3.18E-3 INEG=-3.18E-3
X_H3    OUT N1564479 N1568265 GND 08_COMPLETE_A5_H3_INA290A5
X_IBN         N1565135 GND VICM IBN_INA290A5
X_IBP         N1570299 GND VICM IBP_INA290A5
X_PZ1_17         N1802691 GND N1802699 GND GND PZ1_INA290A5 PARAMS:  GAIN=1 FP=7K
+  FZ=200K R=1E4
X_PZ1_18         N1802699 GND N1802705 GND GND PZ1_INA290A5 PARAMS:  GAIN=1 FP=8K
+  FZ=270K R=10E4
X_PZ1_20         N1802713 GND N1803033 GND GND PZ1_INA290A5 PARAMS:  GAIN=1 FP=3E6
+  FZ=10E6 R=1E7
X_PZ1_21         N1803033 GND N1803039 GND GND PZ1_INA290A5 PARAMS:  GAIN=1 FP=3E6
+  FZ=12E6 R=1E8
X_U3         N1799589 GND N1799595 GND GND ZP1_INA290A5 PARAMS:  GAIN=1 FP=30E3 FZ=300
+  R=1E8
X_U30         VICM GND N1799589 GND DC_REJ_SUB_INA290A5 PARAMS:  DC_REJ=140.5 R=1
X_U39         VS_B GND N1686813 GND DC_REJ_SUB_INA290A5 PARAMS:  DC_REJ=127 R=1
X_U4         N1799595 GND N1799601 GND GND ZP1_INA290A5 PARAMS:  GAIN=1 FP=8E6 FZ=25E3
+  R=1E8
X_U47         N1686813 GND N1686821 GND GND ZP1_INA290A5 PARAMS:  GAIN=1 FP=170K FZ=715
+  R=1E8
X_U48         N1686821 GND N1686827 GND GND ZP1_INA290A5 PARAMS:  GAIN=1 FP=190E3
+  FZ=38E3 R=1E8
X_U5         N1799601 GND CMR GND GND ZP1_INA290A5 PARAMS:  GAIN=1 FP=10E6 FZ=150E3
+  R=1E8
X_U55         N1686827 GND N1686833 GND GND ZP1_INA290A5 PARAMS:  GAIN=1 FP=10E6
+  FZ=800E3 R=1E8
X_U56         N1686833 GND PSR GND GND ZP1_INA290A5 PARAMS:  GAIN=1 FP=12E6 FZ=1.9E6
+  R=1E8
X_U59         VS_B GND VCM_MIN GND VCM_MIN_VAR_INA290A5
X_U75         GND N1566889 GAIN_RES_DRIFT_INA290A5 PARAMS:  G_RES=500.03E3
+  DRIFT_RES_ROOM=1E3 RES_DRIFT=2.5E-3 POL=-1
X_U76         ACL N1564615 GAIN_RES_DRIFT_INA290A5 PARAMS:  G_RES=500.03E3
+  DRIFT_RES_ROOM=1E3 RES_DRIFT=2.5E-3 POL=-1
X_U84         VSENSE GND N1565567 GND P1_INA290A5 PARAMS:  GAIN=1 FP=3.1E6 R=1E6
X_U85         N1565567 GND N1914237 GND P1_INA290A5 PARAMS:  GAIN=1 FP=3.2E6 R=1E6
X_U86         N1914237 GND N1913799 GND P1_INA290A5 PARAMS:  GAIN=1 FP=3.4E6 R=1E6
X_U87         N1913799 GND N1917374 GND P1_INA290A5 PARAMS:  GAIN=1 FP=3.7E6 R=1E6
X_U88         N1917374 GND N1916027 GND P1_INA290A5 PARAMS:  GAIN=1 FP=3.8E6 R=1E6
X_U89         N1916027 GND N1916494 GND P1_INA290A5 PARAMS:  GAIN=1 FP=4E6 R=1E6
X_U90         N1802705 GND N1802713 GND GND ZP1_INA290A5 PARAMS:  GAIN=1 FP=2E6 FZ=300K
+  R=50E4
X_U91         N1570299 GND N1570299 N1565135 IBP_SENSE_INA290A5 PARAMS:  RSENSE=1996
X_VCM_CLAMPN         N1567417 GND N1567177 GND VCM_MAX VCM_MIN VCM_CLAMP_INA290A5
X_VCM_CLAMPP         N1566839 GND N1565881 GND VCM_MAX VCM_MIN VCM_CLAMP_INA290A5
X_VNOISE         N1565263 N1565639 VNOISE_INA290A5 PARAMS:  NV=38
X_VOS_DRIFT         N1565263 N1570299 VOS_DRIFT_INA290A5 PARAMS:  DC=-17E-6 DRIFT=0.2E-6
+  POL=1
X_ZOUT_DC_SUB3         ACL N1803045 N1802691 N1564479 GND ZOUT_DC_SUB_INA290A5 PARAMS:
+  ZOUT_DC=0.103 ZOUT_MAX=300
X_ZP1LIM7         N1803039 GND N1803045 GND GND ZP1LIM_INA290A5 PARAMS:  GAIN=1 FZ=12E6
+  FP=1E11 R=1E12 IPOS=7.8E2 INEG=-1.32E3
.ENDS  INA290A5
*
.SUBCKT 08_COMPLETE_A5_H3_INA290A5 1 2 3 4
H_H3         3 4 VH_H3 -1E3
VH_H3         1 2 0V
.ENDS  08_COMPLETE_A5_H3_INA290A5
*
.SUBCKT AOL_1 VC+ VC- IOUT+ IOUT-
+ PARAMS:
+ GAIN = 1E-4
+ IPOS = .5
+ INEG = -.5
G1 IOUT+ IOUT- VALUE={LIMIT(GAIN*V(VC+,VC-),INEG,IPOS)}
.ENDS  AOL_1
*
.SUBCKT AOL_2_INA290A5 VC+ VC- IOUT+ IOUT-
+ PARAMS:
+ GAIN = 1E-2
+ IPOS = 2.66E-02
+ INEG = -2.66E-02
G1 IOUT+ IOUT- VALUE={LIMIT(GAIN*V(VC+,VC-),INEG,IPOS)}
.ENDS  AOL_2_INA290A5
*
.SUBCKT CLAMP_AMP_HI_INA290A5 VC+ VC- VIN COM VO+ VO-
.PARAM G = 10
GVO+ COM VO+ VALUE = {IF(V(VIN,COM)>V(VC+,COM),((V(VIN,COM)-V(VC+,COM))*G),0)}
GVO- COM VO- VALUE = {IF(V(VIN,COM)<V(VC-,COM),((V(VC-,COM)-V(VIN,COM))*G),0)}
.ENDS  CLAMP_AMP_HI_INA290A5
*
.SUBCKT CLAMP_AMP_LO_INA290A5 VC+ VC- VIN COM VO+ VO-
.PARAM G = 1
GVO+ COM VO+ VALUE = {IF(V(VIN,COM)>V(VC+,COM),((V(VIN,COM)-V(VC+,COM))*G),0)}
GVO- COM VO- VALUE = {IF(V(VIN,COM)<V(VC-,COM),((V(VC-,COM)-V(VIN,COM))*G),0)}
.ENDS  CLAMP_AMP_LO_INA290A5
*
.SUBCKT CLAWN_INA290A5 VC+ VC- IOUT+ IOUT-
G1 IOUT+ IOUT- TABLE {ABS(V(VC+,VC-))} =
+(0, 14E-6)
+(1.26, 1E-4)
+(2.3, 1.8E-4)
+(5, 3.93E-4)
+(10.6, 8.6E-4)
+(15, 1.27E-3)
+(17.6, 1.546E-3)
+(20.3, 1.88E-3)
+(23.1, 2.29E-3)
.ENDS  CLAWN_INA290A5
*
.SUBCKT CLAWP_INA290A5 VC+ VC- IOUT+ IOUT-
G1 IOUT+ IOUT- TABLE {ABS(V(VC+,VC-))}
+(0, 7E-5)
+(0.76169, 1.5E-4)
+(1.13016, 1.6E-4)
+(1.669, 2.19E-4)
+(2.96314, 3.93E-4)
+(4.301, 5.81E-4)
+(6.14937, 8.6E-4)
+(8.5746, 1.27E-3)
+(11.3559, 1.88E-3)
+(13, 2.29E-3)
.ENDS  CLAWP_INA290A5
*
.SUBCKT CLAW_SRC_INA290A5 VC+ VC- IOUT+ IOUT-
+ PARAMS:
+ GAIN = 1
+ IPOS = 7E-2
+ INEG = -8.8E-2
G1 IOUT+ IOUT- VALUE={LIMIT(GAIN*V(VC+,VC-),INEG,IPOS)}
.ENDS  CLAW_SRC_INA290A5
*
.SUBCKT CL_SRC_INA290A5 VC+ VC- IOUT+ IOUT-
+ PARAMS:
+ GAIN = 1
+ IPOS = 1.4E-1
+ INEG = -1.76E-1
G1 IOUT+ IOUT- VALUE={LIMIT(GAIN*V(VC+,VC-),INEG,IPOS)}
.ENDS  CL_SRC_INA290A5
*
.SUBCKT DC_REJ_SUB_INA290A5 VC+ VC- OUT+ OUT-
+ PARAMS:
+ DC_REJ = 120
+ R = 1
.MODEL R_NOISELESS RES (T_ABS=-273.15)
.PARAM GG1 = {PWR(10, (-(DC_REJ)/20))}
G1 OUT- OUT+ VC+ VC- {GG1}
R1 OUT+ OUT- R_NOISELESS  {R}
.ENDS  DC_REJ_SUB_INA290A5
*
.SUBCKT GAIN_RES_DRIFT_INA290A5 1 2
+ PARAMS:
+ G_RES = 20E3
+ DRIFT_RES_ROOM = 100
+ RES_DRIFT = 1E-6
+ POL = 1
.MODEL R_NOISELESS RES (T_ABS=-273.15)
.MODEL R_DRIFT RES (TC1={RES_DRIFT})
R1 1 3 R_NOISELESS {G_RES-DRIFT_RES_ROOM}
R2 2 3 R_DRIFT {DRIFT_RES_ROOM}
.ENDS  GAIN_RES_DRIFT_INA290A5
*
.SUBCKT GR_SRC_INA290A5 VC+ VC- IOUT+ IOUT-
+ PARAMS:
+ GAIN = 1
+ IPOS = 5.32E-2
+ INEG = -5.32E-2
G1 IOUT+ IOUT- VALUE={LIMIT(GAIN*V(VC+,VC-),INEG,IPOS)}
.ENDS  GR_SRC_INA290A5
*
.SUBCKT IBN_INA290A5 VINN GND CM_IN
G1 VINN GND TABLE {(V(CM_IN,GND))} =
+(1, 200E-9)
+(3.5, 19.57E-6)
+(50, 19.975E-6)
+(120, 20.57E-6)
.ENDS  IBN_INA290A5
*
.SUBCKT IBP_INA290A5 VINP GND CM_IN
G1 VINP GND TABLE {(V(CM_IN,GND))} =
+(1, 225E-9)
+(3.5, 19.6E-6)
+(50, 20E-6)
+(120, 20.6E-6)
.ENDS  IBP_INA290A5
*
.SUBCKT IBP_SENSE_INA290A5 VINP GND IB+ IB-
+ PARAMS:
+ RSENSE = 23847
G1 VINP GND VALUE={(V(IB+, GND)-V(IB-,GND))/RSENSE}
.ENDS  IBP_SENSE_INA290A5
*
.SUBCKT P1_INA290A5 VC+ VC- OUT+ OUT-
+ PARAMS:
+ GAIN = 1
+ FP = 1
+ R = 1E6
.MODEL R_NOISELESS RES (T_ABS=-273.15)
.PARAM CC1 = {1/(6.2831853 * FP * R)}
.PARAM GG1 = {GAIN / R}
G1 OUT- OUT+ VC+ VC- {GG1}
R1 OUT+ OUT- R_NOISELESS {R}
C1 OUT+ OUT- {CC1}
.ENDS  P1_INA290A5
*
.SUBCKT PZ1_INA290A5 VC+ VC- OUT+ OUT- 1
+ PARAMS:
+ GAIN = 1
+ FP = 1E3
+ FZ = 1E4
+ R = 1E6
.MODEL R_NOISELESS RES (T_ABS=-273.15)
.PARAM CC1 = {1/(6.2831853 * FZ * R)}
.PARAM RR1 = {(1/(6.2831853 * FP * CC1)) - R}
C1 2 1 {CC1}
G1 OUT- OUT+ 3 1 {GAIN}
R1 VC+ 3 R_NOISELESS {RR1}
R2 3 2 R_NOISELESS {R}
R3 OUT+ OUT- R_NOISELESS 1
.ENDS  PZ1_INA290A5
*
.SUBCKT VCM_CLAMP_INA290A5 VIN+ VIN- IOUT- IOUT+ VP+ VP-
.PARAM GAIN = 1
G1 IOUT+ IOUT- VALUE={LIMIT(GAIN*V(VIN+,VIN-),V(VP-,VIN-), V(VP+,VIN-))}
.ENDS  VCM_CLAMP_INA290A5
*
.SUBCKT VCM_MIN_VAR_INA290A5 VS_IN GND VCM_ACTUAL GND
E1 VCM_ACTUAL GND TABLE {ABS(V(VS_IN,GND))} =
+(2.7, 2.50)
+(5, 2.58)
+(7.5, 3.3)
+(8.75, 3.9)
+(13.75, 5.4)
+(20, 6.88)
.ENDS  VCM_MIN_VAR_INA290A5
*
.SUBCKT VNOISE_INA290A5 1 2
+ PARAMS:
+ NV = 1E3
.PARAM RNV={1.184*PWR(NV,2)}
R4 5 0 {RNV}
R5 5 0 {RNV}
E3 1 2 5 0 10
.ENDS  VNOISE_INA290A5
*
.SUBCKT VOS_DRIFT_INA290A5 VOS+ VOS-
+ PARAMS:
+ DC = 20E-6
+ DRIFT = 1E-6
+ POL = 1
E1 VOS+ VOS- VALUE={DC+POL*DRIFT*(TEMP-27)}
.ENDS  VOS_DRIFT_INA290A5
*
.SUBCKT ZOUT_DC_SUB_INA290A5 INA INB OUTA OUTB COM
+ PARAMS:
+ ZOUT_DC = 1
+ ZOUT_MAX = 1E3
.MODEL R_NOISELESS RES (T_ABS=-273.15)
.PARAM BETA = 1
.PARAM RDUMMY = {10*ZOUT_MAX}
.PARAM RX = {100*ZOUT_MAX}
.PARAM G1 = {RX/(ZOUT_DC*BETA)}
G1 COM OUTA INA OUTB {G1}
R1 OUTA COM R_NOISELESS 1
RDUMMY OUTB COM R_NOISELESS {RDUMMY}
RX INB OUTB R_NOISELESS {RX}
.ENDS  ZOUT_DC_SUB_INA290A5
*
.SUBCKT ZP1_INA290A5 VC+ VC- OUT+ OUT- 1
+ PARAMS:
+ GAIN = 1
+ FZ = 1E3
+ FP = 1E4
+ R = 1E6
.MODEL R_NOISELESS RES (T_ABS=-273.15)
.PARAM GG1 = {GAIN * FP/FZ}
.PARAM CC1 = {1/(6.2831853 * FZ * R)}
.PARAM RR1 = {R/(FP/FZ - 1)}
C1 VC+ 2 {CC1}
G1 OUT- OUT+ 2 1 {GG1}
R1 VC+ 2 R_NOISELESS {R}
R2 2 1 R_NOISELESS {RR1}
R3 OUT+ OUT- R_NOISELESS 1
.ENDS  ZP1_INA290A5
*
.SUBCKT ZP1LIM_INA290A5 VC+ VC- OUT+ OUT- 1
+ PARAMS:
+ GAIN = 1
+ FZ = 1E3
+ FP = 1E4
+ R = 1E6
+ IPOS = 1.72E3
+ INEG = -2.9E3
.MODEL R_NOISELESS RES (T_ABS=-273.15)
.PARAM GG1 = {GAIN * FP/FZ}
.PARAM CC1 = {1/(6.2831853 * FZ * R)}
.PARAM RR1 = {R/(FP/FZ - 1)}
C1 VC+ 2 {CC1}
G1 OUT- OUT+ VALUE={LIMIT(GG1 * V(2, 1), INEG, IPOS)}
R1 VC+ 2 R_NOISELESS {R}
R2 2 1 R_NOISELESS {RR1}
R3 OUT+ OUT- R_NOISELESS 1
.ENDS  ZP1LIM_INA290A5
*
.model MYSW SW(Ron=.1m Roff=1Meg Vt = 2.5 Vh = -.4)
.param start_res=100
.param end_res 1
* .ic V(vir_gnd) = {vbat-5.1}
.param vbat = 100
.backanno
.end